# Altium project FMC_ADC_100M_10B_16CHA_TDC.PrjPCB (part 4 of 5)

## Sheet CFD.SchDoc: FMC_ADC
size 420 x 297 mm; Author: G.Kasprowicz; CompanyName: WUT ISE; DrawnBy: G.Kasprowicz; Organization: WUT ISE; Address1: PW ISE; Address2: Nowowiejska 15/19 00-665 Warsaw; Address3: gkasprow@gmail.com; Revision: 2; SheetNumber: -; SheetTotal: -; ModifiedBy: -; CheckedDate: -; Title2: CFD, ADC driver; DivGrp: WUT ISE; Designer: G.Kasprowicz; ModifiedDate: -; ProjectName: Sensor Box
Used 16 times, as channels U_CFD0, U_CFD1, U_CFD2, U_CFD3, U_CFD4, U_CFD5, U_CFD6, U_CFD7, U_CFD8, U_CFD9, U_CFD10, U_CFD11, U_CFD12, U_CFD13, U_CFD14, U_CFD15. Parts and nets are listed once, with the designators drawn on the sheet.
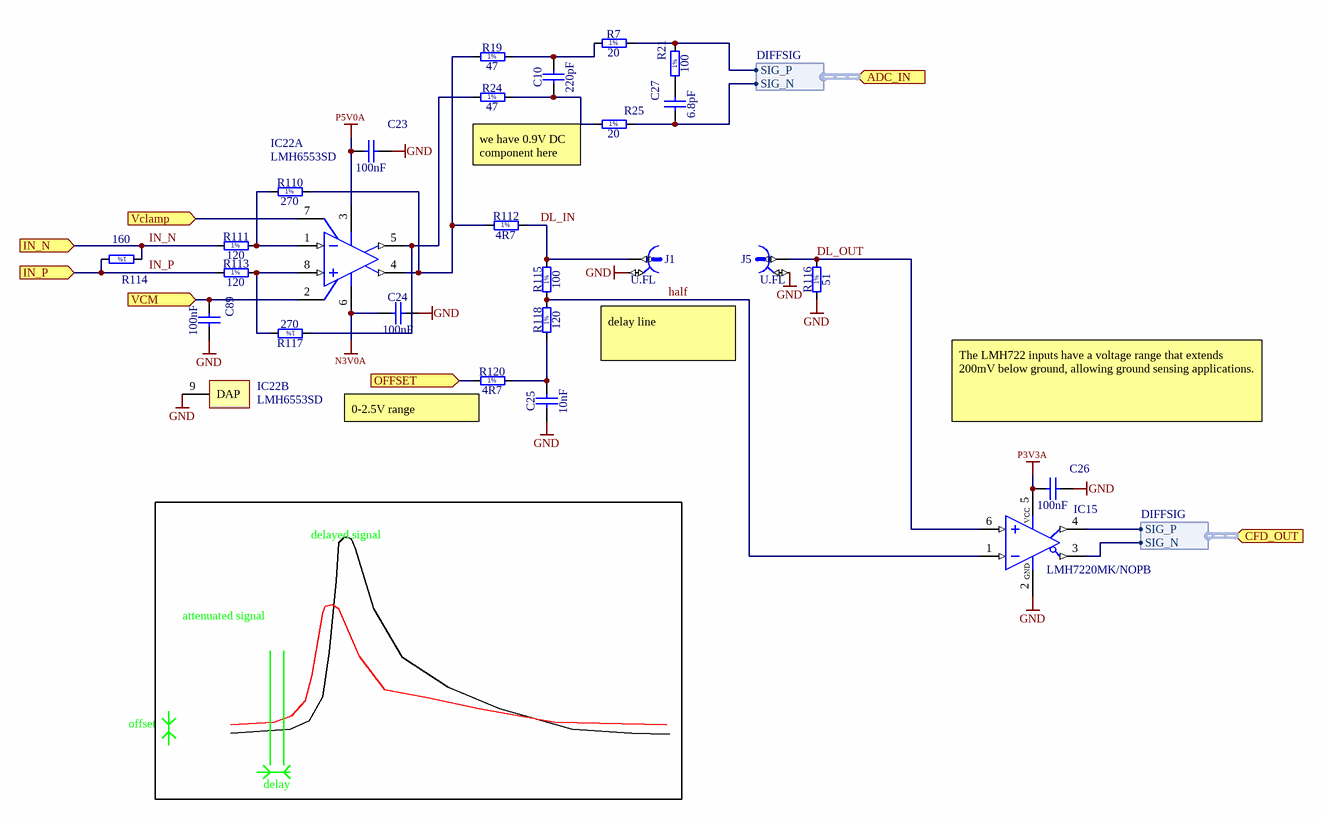
[diagram p8: CFD.SchDoc]

### Parts
C10  220pF  [CAPC1005X55N]
C23  100nF  [CAPC0603X33N]
C24  100nF  [CAPC0603X33N]
C25  10nF  [CAPC1005X55N]
C26  100nF  [CAPC0603X33N]
C27  6.8pF  [CAPC1005X70N]
C89  100nF  [CAPC0603X33N]
IC15  LMH7220MK/NOPB  [SOT95P285X100-6N]
IC22  LMH6553SD  [SDA08C]  (parts A,B of 2)
J1  U.FL  [HIROSE_U.FL-R-SMT-1(10)]
J5  U.FL  [HIROSE_U.FL-R-SMT-1(10)]
R7  20  [RESC1005X40N]
R19  47  [RESC1005X40N]
R21  100  [RESC0603X28N]
R24  47  [RESC1005X40N]
R25  20  [RESC1005X40N]
R110  270  [RESC1005X40N]
R111  120  [RESC1005X40N]
R112  4R7  [RESC1005X40N]
R113  120  [RESC1005X40N]
R114  160  [RESC1005X40N]
R115  100  [RESC0603X28N]
R116  51  [RESC1005X40N]
R117  270  [RESC1005X40N]
R118  120  [RESC1005X40N]
R120  4R7  [RESC1005X40N]

### Ports
ADC_IN (in, harness DIFFSIG), CFD_OUT (in, harness DIFFSIG), IN_N (in), IN_P (in), OFFSET (in), Vclamp (in), VCM (in)

### Harnesses
DIFFSIG: SIG_P, SIG_N

### Nets
GND: C23.2 C24.2 C25.1 C26.2 C89.2 IC15.2(GND) IC22.9(DAP) J1.2 J5.2 R116.1
N3V0A: C24.1 IC22.6(V-)
P3V3A: C26.1 IC15.5(VCC)
P5V0A: C23.1 IC22.3(V+)
DL_IN: J1.1 R112.2 R115.2
DL_OUT: IC15.6(IN+) J5.1 R116.2
half: IC15.1(IN-) R115.1 R118.2
IN_N: R111.1 R114.1 ; port IN_N
IN_P: R113.1 R114.2 ; port IN_P
OFFSET: R120.1 ; port OFFSET
Vclamp: IC22.7(VCLAMP) ; port Vclamp
VCM: C89.1 IC22.2(VCM) ; port VCM
NetC10_1: C10.1 R24.2 R25.1
NetC10_2: C10.2 R7.1 R19.2
NetC25_2: C25.2 R118.1 R120.2
NetC27_1: C27.1 R25.2 ; port ADC_IN.SIG_N
NetC27_2: C27.2 R21.1
NetIC15_3: IC15.3(VOUT~{Q}) ; port CFD_OUT.SIG_N
NetIC15_4: IC15.4(VOUTQ) ; port CFD_OUT.SIG_P
NetIC22_1: IC22.1(IN-) R110.1 R111.2
NetIC22_4: IC22.4(OUT+) R19.1 R110.2 R112.1
NetIC22_5: IC22.5(OUT-) R24.1 R117.1
NetIC22_8: IC22.8(IN+) R113.2 R117.2
NetR7_2: R7.2 R21.2 ; port ADC_IN.SIG_P

### Channels
U_CFD0: designators end in A; ports IN_N=IN0_N IN_P=IN0_P OFFSET=CFD_OFFSET0 Vclamp=CFD_CLAMP VCM=VCM0
U_CFD1: designators end in B; ports IN_N=IN1_N IN_P=IN1_P OFFSET=CFD_OFFSET1 Vclamp=CFD_CLAMP VCM=VCM0
U_CFD2: designators end in C; ports IN_N=IN2_N IN_P=IN2_P OFFSET=CFD_OFFSET2 Vclamp=CFD_CLAMP VCM=VCM0
U_CFD3: designators end in D; ports IN_N=IN3_N IN_P=IN3_P OFFSET=CFD_OFFSET3 Vclamp=CFD_CLAMP VCM=VCM0
U_CFD4: designators end in E; ports IN_N=IN4_N IN_P=IN4_P OFFSET=CFD_OFFSET4 Vclamp=CFD_CLAMP VCM=VCM0
U_CFD5: designators end in F; ports IN_N=IN5_N IN_P=IN5_P OFFSET=CFD_OFFSET5 Vclamp=CFD_CLAMP VCM=VCM0
U_CFD6: designators end in G; ports IN_N=IN6_N IN_P=IN6_P OFFSET=CFD_OFFSET6 Vclamp=CFD_CLAMP VCM=VCM0
U_CFD7: designators end in H; ports IN_N=IN7_N IN_P=IN7_P OFFSET=CFD_OFFSET7 Vclamp=CFD_CLAMP VCM=VCM0
U_CFD8: designators end in I; ports IN_N=IN8_N IN_P=IN8_P OFFSET=CFD_OFFSET8 Vclamp=CFD_CLAMP VCM=VCM1
U_CFD9: designators end in J; ports IN_N=IN9_N IN_P=IN9_P OFFSET=CFD_OFFSET9 Vclamp=CFD_CLAMP VCM=VCM1
U_CFD10: designators end in K; ports IN_N=IN10_N IN_P=IN10_P OFFSET=CFD_OFFSET10 Vclamp=CFD_CLAMP VCM=VCM1
U_CFD11: designators end in L; ports IN_N=IN11_N IN_P=IN11_P OFFSET=CFD_OFFSET11 Vclamp=CFD_CLAMP VCM=VCM1
U_CFD12: designators end in M; ports IN_N=IN12_N IN_P=IN12_P OFFSET=CFD_OFFSET12 Vclamp=CFD_CLAMP VCM=VCM1
U_CFD13: designators end in N; ports IN_N=IN13_N IN_P=IN13_P OFFSET=CFD_OFFSET13 Vclamp=CFD_CLAMP VCM=VCM1
U_CFD14: designators end in O; ports IN_N=IN14_N IN_P=IN14_P OFFSET=CFD_OFFSET14 Vclamp=CFD_CLAMP VCM=VCM1
U_CFD15: designators end in P; ports IN_N=IN15_N IN_P=IN15_P OFFSET=CFD_OFFSET15 Vclamp=CFD_CLAMP VCM=VCM1

### Notes on the sheet
- we have 0.9V DC component here
- delay line
- (near R120) 0-2.5V range
- The LMH722 inputs have a voltage range that extends  200mV below ground, allowing ground sensing applications.
- delayed signal
- attenuated signal
- offset
- delay
- Project/Equipment
- Document
- Designer
- Drawn by
- Check.by
- Copyright WUT ISE 2018.
  This documentation describes Open Hardware and is licensed under the CERN OHL v.1.1. You may redistribute and modify this documentation under the terms of the CERN OHL v.1.1. (http://ohwr.org/CERNOHL). This documentation is distributed WITHOUT ANY EXPRESS OR IMPLIED WARRANTY, INCLUDING OF MERCHANTABILITY, SATISFACTORY QUALITY AND FITNESS FOR A PARTICULAR PURPOSE. Please see the CERN OHL v.1.1 for applicable conditions.
- Contact
- File
- Last Mod.
- Print Date
- Sheet
- Size
- A3
- of
- Rev
- (in symbol R0201_100R_1%_0.05W_200PPM) 1%
- (in symbol R0402_4R7_1%_0.0625W_200PPM) 1%
- (in symbol R0402_20R_1%_0.0625W_100PPM) 1%
- (in symbol R0402_47R_1%_0.0625W_100PPM) 1%
- (in symbol R0402_51R_1%_0.0625W_100PPM) 1%
- (in symbol R0402_120R_1%_0.0625W_100PPM) 1%
- (in symbol R0402_160R_1%_0.0625W_100PPM) 1%
- (in symbol R0402_270R_1%_0.0625W_100PPM) 1%

### Library data of the parts
C10 = CC0402_220PF_50V_5%_C0G: Non-polarised capacitor; Part Description: SMD Multilayer Chip Ceramic Capacitor; Manufacturer: GENERIC; Manufacturer1 Part Number: C0402C221J5GACTU; Voltage: 50V; TC: C0G/NP0; Tolerance: ±5%; Part Number: CC0402_220PF_50V_5%_C0G; Component Kind: Standard; Component Type: Standard; Pin Count: 2; Value: 220pF; Status: Preferred; Manufacturer Part Number: CC0402_220PF_50V_5%_C0G; Case: 0402; Mounted: Yes; Socket: No; SMD: Yes; Sense: No; Manufacturer1 ComponentHeight: 0.55mm; HelpURL: \\cern.ch\dfs\Applications\Altium\Datasheets\CC0805_C0G_KEMET_(Commercial Grade).pdf; Author: CERN DEM JLC; CreateDate: 03.12.2007; LatestRevisionDate: 22.04.2015; Manufacturer1 Example: KEMET
C23 C24 C26 C89 = CC0201_100NF_6.3V_10%_X5R: Non-polarised capacitor; Part Description: SMD Multilayer Chip Ceramic Capacitor; Manufacturer: GENERIC; Manufacturer1 Part Number: 02016D104KAT2A; Voltage: 6.3V; TC: X5R; Tolerance: ±10%; Part Number: CC0201_100NF_6.3V_10%_X5R; Component Kind: Standard; Component Type: Standard; Pin Count: 2; Value: 100nF; Status: Not Recommended; Manufacturer Part Number: CC0201_100NF_6.3V_10%_X5R; Case: 0201; Mounted: Yes; Socket: No; SMD: Yes; Sense: No; Manufacturer1 Example: AVX; Manufacturer1 ComponentHeight: 0.33mm; HelpURL: \\cern.ch\dfs\Applications\Altium\Datasheets\CC0201_X5R_AVX.pdf; Author: CERN DEM JLC; CreateDate: 03.12.2007; LatestRevisionDate: 03.12.2007
C25 = CC0402_10NF_16V_10%_X7R: Non-polarised capacitor; Part Description: SMD Multilayer Chip Ceramic Capacitor; Manufacturer: GENERIC; Manufacturer1 Part Number: 223878715636; Voltage: 16V; TC: X7R; Tolerance: ±10%; Part Number: CC0402_10NF_16V_10%_X7R; Component Kind: Standard; Component Type: Standard; Pin Count: 2; Value: 10nF; Status: Not Recommended; Manufacturer Part Number: CC0402_10NF_16V_10%_X7R; Case: 0402; Mounted: Yes; Socket: No; SMD: Yes; Sense: No; Manufacturer1 Example: PHYCOMP; Manufacturer1 ComponentHeight: 0.55mm; HelpURL: \\cern.ch\dfs\Applications\Altium\Datasheets\CC0402_X7R_PHYCOMP.pdf; Author: CERN DEM JLC; CreateDate: 03.12.2007; LatestRevisionDate: 03.12.2007
C27 = CC0402_6.8PF_50V_0.25PF_C0G_VISHAY_VJ_NON-MAGNETIC: Non-polarised capacitor; Part Description: Surface Mount Multilayer Ceramic Chip Capacitors for Non-Magnetic Applications (IR Reflow Soldering); Manufacturer: VISHAY VITRAMON; Manufacturer Part Number: VJ0402A6R8CCAA; Voltage: 50V; TC: C0G/NP0; Tolerance: ±0.25pF; Part Number: CC0402_6.8PF_50V_0.25PF_C0G_VISHAY_VJ_NON-MAGNETIC; Component Kind: Standard; Component Type: Standard; Pin Count: 2; Value: 6.8pF; Status: Not Recommended; Case: 0402; Mounted: Yes; Socket: No; SMD: Yes; Sense: No; ComponentHeight: 0.64mm; HelpURL: \\cern.ch\dfs\Applications\Altium\Datasheets\CC0402_VISHAY_VJ_NON-MAGNETIC.pdf; Author: CERN DEM MR; CreateDate: 22.06.2016; LatestRevisionDate: 03.03.2017
IC15 = LMH7220MK/NOPB: High Speed Comparator with LVDS Output; Manufacturer: NATIONAL SEMICONDUCTOR; PressFit: No; Bonding: No; Part Number: LMH7220MK/NOPB; Component Kind: Standard; Component Type: Standard; Device: LMH7220MK/NOPB; PackageDescription: 0.95mm, pitch; 6 pin, 1.65mm W X 2.97mm L X 1.00mm H body IPC Medium Density; Part Description: High Speed Comparator with LVDS Output; Manufacturer Part Number: LMH7220MK/NOPB; Pin Count: 6; Case: SOT23-6; Mounted: Yes; Socket: No; SMD: Yes; Sense: No; ComponentHeight: 1mm; Author: CERN DEM JLC; HelpURL: \\cern.ch\dfs\Applications\Altium\Datasheets\LMH7220MK-NOPB.pdf; CreateDate: 30.03.2010; LatestRevisionDate: 30.03.2010
IC22 = CMP-0055-00983-1: 900 MHz Fully Differential Amplifier with Output Limiting Clamp, 8-pin LLP; Manufacturer: National Semiconductor; CompType: Amplifiers; PowerWise: Y; PackageTopMarking: XYTT*6553; PackageVersion: revA, Jan-2004; PackageDescription: LLP, Plastic, Dual, 2.5 x 3.0 x 0.8mm Body, 8 Lead, 0.5mm Pitch, No Pullback; PinCount: 8; PackageReference: SDA08C; DatasheetVersion: Nov-2008; RoHS: Y
J1 J5 = HIROSE_U.FL-R-SMT-1(10): Part Description: Up to 6GHz Ultra Small Surface Mount Male Coaxial Connectors U.FL Series; Manufacturer: HIROSE (HRS); PressFit: No; Part Number: HIROSE_U.FL-R-SMT-1(10); Component Kind: Standard; Component Type: Standard; Pin Count: 2; Family: U.FL; Mounted: Yes; Socket: No; SMD: Yes; Sense: No; Status: None; Manufacturer Part Number: U.FL-R-SMT-1(10); ComponentHeight: 1.25mm; HelpURL: \\cern.ch\dfs\Applications\Altium\Datasheets\HIROSE_U.FL-R-SMT-1(10).pdf; Author: CERN DEM JLC; CreateDate: 24.03.2010; LatestRevisionDate: 24.03.2010
R7 R25 = R0402_20R_1%_0.0625W_100PPM: Resistor - 1%; Part Description: General Purpose Thick Film Chip Resistor; Manufacturer: GENERIC; Manufacturer1 Part Number: 232270672009L; TC: ±100ppm/°C; PressFit: No; Part Number: R0402_20R_1%_0.0625W_100PPM; Component Kind: Standard; Component Type: Standard; Pin Count: 2; Value: 20; Status: Not Recommended; Power: 0.0625W; Tolerance: ±1%; Manufacturer Part Number: R0402_20R_1%_0.0625W_100PPM; Case: 0402; Mounted: Yes; Sense: No; Socket: No; SMD: Yes; Manufacturer1 Example: YAGEO PHYCOMP; Manufacturer1 ComponentHeight: 0.4mm; HelpURL: \\cern.ch\dfs\Applications\Altium\Datasheets\R0402_Phycomp_RC0402.pdf; Author: CERN DEM JLC; CreateDate: 03.12.2007; LatestRevisionDate: 17.10.2012
R19 R24 = R0402_47R_1%_0.0625W_100PPM: Resistor - 1%; Part Description: General Purpose Thick Film Chip Resistor; Manufacturer: GENERIC; Manufacturer1 Part Number: 232270674709L; TC: ±100ppm/°C; PressFit: No; Part Number: R0402_47R_1%_0.0625W_100PPM; Component Kind: Standard; Component Type: Standard; Pin Count: 2; Value: 47; Status: Not Recommended; Power: 0.0625W; Tolerance: ±1%; Manufacturer Part Number: R0402_47R_1%_0.0625W_100PPM; Case: 0402; Mounted: Yes; Sense: No; Socket: No; SMD: Yes; Manufacturer1 Example: YAGEO PHYCOMP; Manufacturer1 ComponentHeight: 0.4mm; HelpURL: \\cern.ch\dfs\Applications\Altium\Datasheets\R0402_Phycomp_RC0402.pdf; Author: CERN DEM JLC; CreateDate: 03.12.2007; LatestRevisionDate: 17.10.2012
R21 R115 = R0201_100R_1%_0.05W_200PPM: Resistor - 1%; Part Description: Thick Film Chip Resistor; Manufacturer: GENERIC; Manufacturer1 Part Number: CRCW0201100RFNED; Power: 0.05W; TC: ±200ppm/°C; PressFit: No; Part Number: R0201_100R_1%_0.05W_200PPM; Component Kind: Standard; Component Type: Standard; Pin Count: 2; Value: 100; Status: Not Recommended; Tolerance: ±1%; Manufacturer Part Number: R0201_100R_1%_0.05W_200PPM; Case: 0201; Mounted: Yes; Sense: No; Socket: No; SMD: Yes; Manufacturer1 Example: VISHAY; Manufacturer1 ComponentHeight: 0.27mm; HelpURL: \\cern.ch\dfs\Applications\Altium\Datasheets\R0201_VISHAY_CRCW0201 e3.pdf; Author: CERN DEM JLC; CreateDate: 13.11.2014; LatestRevisionDate: 13.11.2014
R110 R117 = R0402_270R_1%_0.0625W_100PPM: Resistor - 1%; Part Description: General Purpose Thick Film Chip Resistor; Manufacturer: GENERIC; Manufacturer1 Part Number: 232270672701L; TC: ±100ppm/°C; PressFit: No; Part Number: R0402_270R_1%_0.0625W_100PPM; Component Kind: Standard; Component Type: Standard; Pin Count: 2; Value: 270; Status: Not Recommended; Power: 0.0625W; Tolerance: ±1%; Manufacturer Part Number: R0402_270R_1%_0.0625W_100PPM; Case: 0402; Mounted: Yes; Sense: No; Socket: No; SMD: Yes; Manufacturer1 Example: YAGEO PHYCOMP; Manufacturer1 ComponentHeight: 0.4mm; HelpURL: \\cern.ch\dfs\Applications\Altium\Datasheets\R0402_Phycomp_RC0402.pdf; Author: CERN DEM JLC; CreateDate: 03.12.2007; LatestRevisionDate: 17.10.2012
R111 R113 R118 = R0402_120R_1%_0.0625W_100PPM: Resistor - 1%; Part Description: General Purpose Thick Film Chip Resistor; Manufacturer: GENERIC; Manufacturer1 Part Number: 232270671201L; TC: ±100ppm/°C; PressFit: No; Part Number: R0402_120R_1%_0.0625W_100PPM; Component Kind: Standard; Component Type: Standard; Pin Count: 2; Value: 120; Status: Not Recommended; Power: 0.0625W; Tolerance: ±1%; Manufacturer Part Number: R0402_120R_1%_0.0625W_100PPM; Case: 0402; Mounted: Yes; Sense: No; Socket: No; SMD: Yes; Manufacturer1 Example: YAGEO PHYCOMP; Manufacturer1 ComponentHeight: 0.4mm; HelpURL: \\cern.ch\dfs\Applications\Altium\Datasheets\R0402_Phycomp_RC0402.pdf; Author: CERN DEM JLC; CreateDate: 03.12.2007; LatestRevisionDate: 17.10.2012
R112 R120 = R0402_4R7_1%_0.0625W_200PPM: Resistor - 1%; Part Description: General Purpose Thick Film Chip Resistor; Manufacturer: GENERIC; Manufacturer1 Part Number: 232270674708L; TC: ±200ppm/°C; PressFit: No; Part Number: R0402_4R7_1%_0.0625W_200PPM; Component Kind: Standard; Component Type: Standard; Pin Count: 2; Value: 4R7; Status: Not Recommended; Power: 0.0625W; Tolerance: ±1%; Manufacturer Part Number: R0402_4R7_1%_0.0625W_200PPM; Case: 0402; Mounted: Yes; Sense: No; Socket: No; SMD: Yes; Manufacturer1 Example: YAGEO PHYCOMP; Manufacturer1 ComponentHeight: 0.4mm; HelpURL: \\cern.ch\dfs\Applications\Altium\Datasheets\R0402_Phycomp_RC0402.pdf; Author: CERN DEM JLC; CreateDate: 03.12.2007; LatestRevisionDate: 17.10.2012
R114 = R0402_160R_1%_0.0625W_100PPM: Resistor - 1%; Part Description: General Purpose Thick Film Chip Resistor; Manufacturer: GENERIC; Manufacturer1 Part Number: 232270671601L; TC: ±100ppm/°C; PressFit: No; Part Number: R0402_160R_1%_0.0625W_100PPM; Component Kind: Standard; Component Type: Standard; Pin Count: 2; Value: 160; Status: Not Recommended; Power: 0.0625W; Tolerance: ±1%; Manufacturer Part Number: R0402_160R_1%_0.0625W_100PPM; Case: 0402; Mounted: Yes; Sense: No; Socket: No; SMD: Yes; Manufacturer1 Example: YAGEO PHYCOMP; Manufacturer1 ComponentHeight: 0.4mm; HelpURL: \\cern.ch\dfs\Applications\Altium\Datasheets\R0402_Phycomp_RC0402.pdf; Author: CERN DEM JLC; CreateDate: 03.12.2007; LatestRevisionDate: 17.10.2012
R116 = R0402_51R_1%_0.0625W_100PPM: Resistor - 1%; Part Description: General Purpose Thick Film Chip Resistor; Manufacturer: GENERIC; Manufacturer1 Part Number: 232270675109L; TC: ±100ppm/°C; PressFit: No; Part Number: R0402_51R_1%_0.0625W_100PPM; Component Kind: Standard; Component Type: Standard; Pin Count: 2; Value: 51; Status: Not Recommended; Power: 0.0625W; Tolerance: ±1%; Manufacturer Part Number: R0402_51R_1%_0.0625W_100PPM; Case: 0402; Mounted: Yes; Sense: No; Socket: No; SMD: Yes; Manufacturer1 Example: YAGEO PHYCOMP; Manufacturer1 ComponentHeight: 0.4mm; HelpURL: \\cern.ch\dfs\Applications\Altium\Datasheets\R0402_Phycomp_RC0402.pdf; Author: CERN DEM JLC; CreateDate: 03.12.2007; LatestRevisionDate: 17.10.2012

## Sheet DACs.SchDoc: FMC_ADC
size 420 x 297 mm; Author: G.Kasprowicz; CompanyName: WUT ISE; DrawnBy: G.Kasprowicz; Organization: WUT ISE; Address1: PW ISE; Address2: Nowowiejska 15/19 00-665 Warsaw; Address3: gkasprow@gmail.com; Revision: 2; SheetNumber: -; SheetTotal: -; ModifiedBy: -; CheckedDate: -; Title2: CFD Offset DAC; DivGrp: WUT ISE; Designer: G.Kasprowicz; ModifiedDate: -; ProjectName: Sensor Box
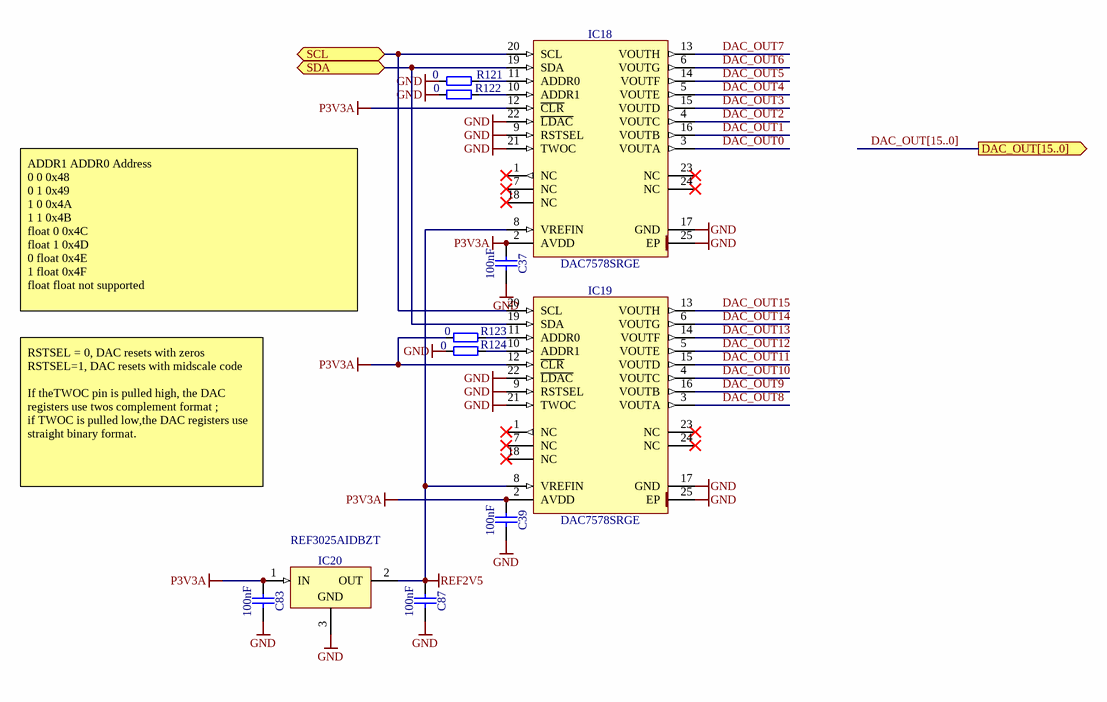
[diagram p9: DACs.SchDoc]

### Parts
C37  100nF  [CAPC0603X33N]
C39  100nF  [CAPC0603X33N]
C83  100nF  [CAPC0603X33N]
C87  100nF  [CAPC0603X33N]
IC18  DAC7578SRGE  [QFN50P400X400X100-25N-S280]
IC19  DAC7578SRGE  [QFN50P400X400X100-25N-S280]
IC20  REF3025AIDBZT  [SOT95P237X112-3N]
R121  0  [RESC1005X40N]
R122  0  [RESC1005X40N]
R123  0  [RESC1005X40N]
R124  0  [RESC1005X40N]

### Ports
DAC_OUT[15..0] (out), SCL (bidir), SDA (bidir)

### Nets
GND: C37.2 C39.2 C83.2 C87.2 IC18.9(RSTSEL) IC18.17(GND) IC18.21(TWOC) IC18.22(~{LDAC}) IC18.25(EP) IC19.9(RSTSEL) IC19.17(GND) IC19.21(TWOC) IC19.22(~{LDAC}) IC19.25(EP) IC20.3(GND) R121.1 R122.1 R124.1
P3V3A: C37.1 C39.1 C83.1 IC18.2(AVDD) IC18.12(~{CLR}) IC19.2(AVDD) IC19.12(~{CLR}) IC20.1(IN) R123.1  [project net DVDD33]
REF2V5: C87.1 IC18.8(VREFIN) IC19.8(VREFIN) IC20.2(OUT)
DAC_OUT0: IC18.3(VOUTA)  [project net CFD_OFFSET0]
DAC_OUT1: IC18.16(VOUTB)  [project net CFD_OFFSET1]
DAC_OUT2: IC18.4(VOUTC)  [project net CFD_OFFSET2]
DAC_OUT3: IC18.15(VOUTD)  [project net CFD_OFFSET3]
DAC_OUT4: IC18.5(VOUTE)  [project net CFD_OFFSET4]
DAC_OUT5: IC18.14(VOUTF)  [project net CFD_OFFSET5]
DAC_OUT6: IC18.6(VOUTG)  [project net CFD_OFFSET6]
DAC_OUT7: IC18.13(VOUTH)  [project net CFD_OFFSET7]
DAC_OUT8: IC19.3(VOUTA)  [project net CFD_OFFSET8]
DAC_OUT9: IC19.16(VOUTB)  [project net CFD_OFFSET9]
DAC_OUT10: IC19.4(VOUTC)  [project net CFD_OFFSET10]
DAC_OUT11: IC19.15(VOUTD)  [project net CFD_OFFSET11]
DAC_OUT12: IC19.5(VOUTE)  [project net CFD_OFFSET12]
DAC_OUT13: IC19.14(VOUTF)  [project net CFD_OFFSET13]
DAC_OUT14: IC19.6(VOUTG)  [project net CFD_OFFSET14]
DAC_OUT15: IC19.13(VOUTH)  [project net CFD_OFFSET15]
NetIC18_10: IC18.10(ADDR1) R122.2
NetIC18_11: IC18.11(ADDR0) R121.2
NetIC18_19: IC18.19(SDA) IC19.19(SDA) ; port SDA
NetIC18_20: IC18.20(SCL) IC19.20(SCL) ; port SCL
NetIC19_10: IC19.10(ADDR1) R124.2
NetIC19_11: IC19.11(ADDR0) R123.2

Not connected (* = marked no-connect by the designer): IC18 1(NC)* 7(NC)* 18(NC)* 23(NC)* 24(NC)*; IC19 1(NC)* 7(NC)* 18(NC)* 23(NC)* 24(NC)*

### Buses and harness runs
bus DAC_OUT[15..0] = port DAC_OUT[15..0]

### Notes on the sheet
- ADDR1	ADDR0	Address
  0	0	0x48
  0	1	0x49
  1	0	0x4A
  1	1	0x4B
  float	0	0x4C
  float	1	0x4D
  0	float	0x4E
  1	float	0x4F
  float	float	not supported
- RSTSEL = 0, DAC resets with zeros
  RSTSEL=1, DAC resets with midscale code
  If theTWOC pin is pulled high, the DAC registers use twos complement format ;
  if TWOC is pulled low,the DAC registers use straight binary format.
- Project/Equipment
- Document
- Designer
- Drawn by
- Check.by
- Copyright WUT ISE 2018.
  This documentation describes Open Hardware and is licensed under the CERN OHL v.1.1. You may redistribute and modify this documentation under the terms of the CERN OHL v.1.1. (http://ohwr.org/CERNOHL). This documentation is distributed WITHOUT ANY EXPRESS OR IMPLIED WARRANTY, INCLUDING OF MERCHANTABILITY, SATISFACTORY QUALITY AND FITNESS FOR A PARTICULAR PURPOSE. Please see the CERN OHL v.1.1 for applicable conditions.
- Contact
- File
- Last Mod.
- Print Date
- Sheet
- Size
- A3
- of
- Rev

### Library data of the parts
C37 C39 C83 C87 = CC0201_100NF_6.3V_10%_X5R: as C23 on sheet CFD; Part Number: CC0201_100NF_6.3V_10%_X5R; Component Kind: Standard; Component Type: Standard; Pin Count: 2; Value: 100nF; Status: Not Recommended; Manufacturer Part Number: CC0201_100NF_6.3V_10%_X5R; Case: 0201; Mounted: Yes; Socket: No; SMD: Yes; Sense: No; Manufacturer1 Example: AVX; Manufacturer1 ComponentHeight: 0.33mm; HelpURL: \\cern.ch\dfs\Applications\Altium\Datasheets\CC0201_X5R_AVX.pdf; Author: CERN DEM JLC; CreateDate: 03.12.2007; LatestRevisionDate: 03.12.2007
IC18 IC19 = DAC7578SRGE: 8-Bit, Octal-Channel, Ultra-Low Glitch, Voltage Output, Two-Wire Interface Digital-to-Analog Converter; Part Description: 12-Bit, Octal-Channel, Ultra-Low Glitch, Voltage Output, Two-Wire Interface Digital-To-Analog Converters; Manufacturer: TEXAS INSTRUMENTS; PressFit: No; Bonding: No; Part Number: DAC7578SRGE; Component Kind: Standard; Component Type: Standard; Device: DAC7578SRGE; PackageDescription: QFN, 0.50mm Pitch, Square; 24 Pin, 4.00mm L X 4.00mm W X 1.00mm H body(w/thermal tab 2.8 X 2.8mm), IPC Medium Density; Manufacturer Part Number: DAC7578SRGE; Pin Count: 25; Case: QFN24; Mounted: Yes; Socket: No; SMD: Yes; Sense: No; ComponentHeight: 1mm; Author: CERN DEM MR; HelpURL: \\cern.ch\dfs\Applications\Altium\Datasheets\DAC7578SRGE.pdf; CreateDate: 14.07.2016; LatestRevisionDate: 14.07.2016
IC20 = REF3025AIDBZT: 3-Terminal Regulator 1=IN 2=OUT 3=GND; Part Description: 2.5V, 50ppm/°C Max, 50uA, CMOS Voltage Reference; Manufacturer: TEXAS INSTRUMENTS; PressFit: No; Bonding: No; Part Number: REF3025AIDBZT; Component Kind: Standard; Component Type: Standard; Device: REF3025AIDBZT; PackageDescription: SOT, 0.95mm, pitch; 3 pin,1.30mm W X 2.92mm L X 1.12mm H body, IPC Medium Density; Manufacturer Part Number: REF3025AIDBZT; Pin Count: 3; Case: SOT23; Mounted: Yes; Socket: No; SMD: Yes; Sense: No; ComponentHeight: 1.12mm; HelpURL: \\cern.ch\dfs\Applications\Altium\Datasheets\REF3025AIDBZT.pdf; Author: CERN DEM JLC; CreateDate: 19.12.2016; LatestRevisionDate: 19.12.2016
R121-R124 = R0402_0R_JUMPER: Resistor; Part Description: 1A (0.05R Max DC Resistance) Zero Ohm Jumper; Manufacturer: GENERIC; Manufacturer1 Part Number: 232270591001L; PressFit: No; Part Number: R0402_0R_JUMPER; Component Kind: Standard; Component Type: Standard; Pin Count: 2; Value: 0; Status: Not Recommended; Manufacturer Part Number: R0402_0R_JUMPER; Case: 0402; Mounted: Yes; Sense: No; Socket: No; SMD: Yes; Manufacturer1 Example: YAGEO PHYCOMP; Manufacturer1 ComponentHeight: 0.4mm; HelpURL: \\cern.ch\dfs\Applications\Altium\Datasheets\R0402_Phycomp_RC0402.pdf; Author: CERN DEM JLC; CreateDate: 03.12.2007; LatestRevisionDate: 17.10.2012

## Sheet Translators.SchDoc: FMC_ADC
size 420 x 297 mm; Author: G.Kasprowicz; CompanyName: WUT ISE; DrawnBy: G.Kasprowicz; Organization: WUT ISE; Address1: PW ISE; Address2: Nowowiejska 15/19 00-665 Warsaw; Address3: gkasprow@gmail.com; Revision: 2; SheetNumber: -; SheetTotal: -; ModifiedBy: -; CheckedDate: -; Title2: 100M_10B_16CHA_TDC; DivGrp: WUT ISE; Designer: G.Kasprowicz; ModifiedDate: -; ProjectName: Sensor Box
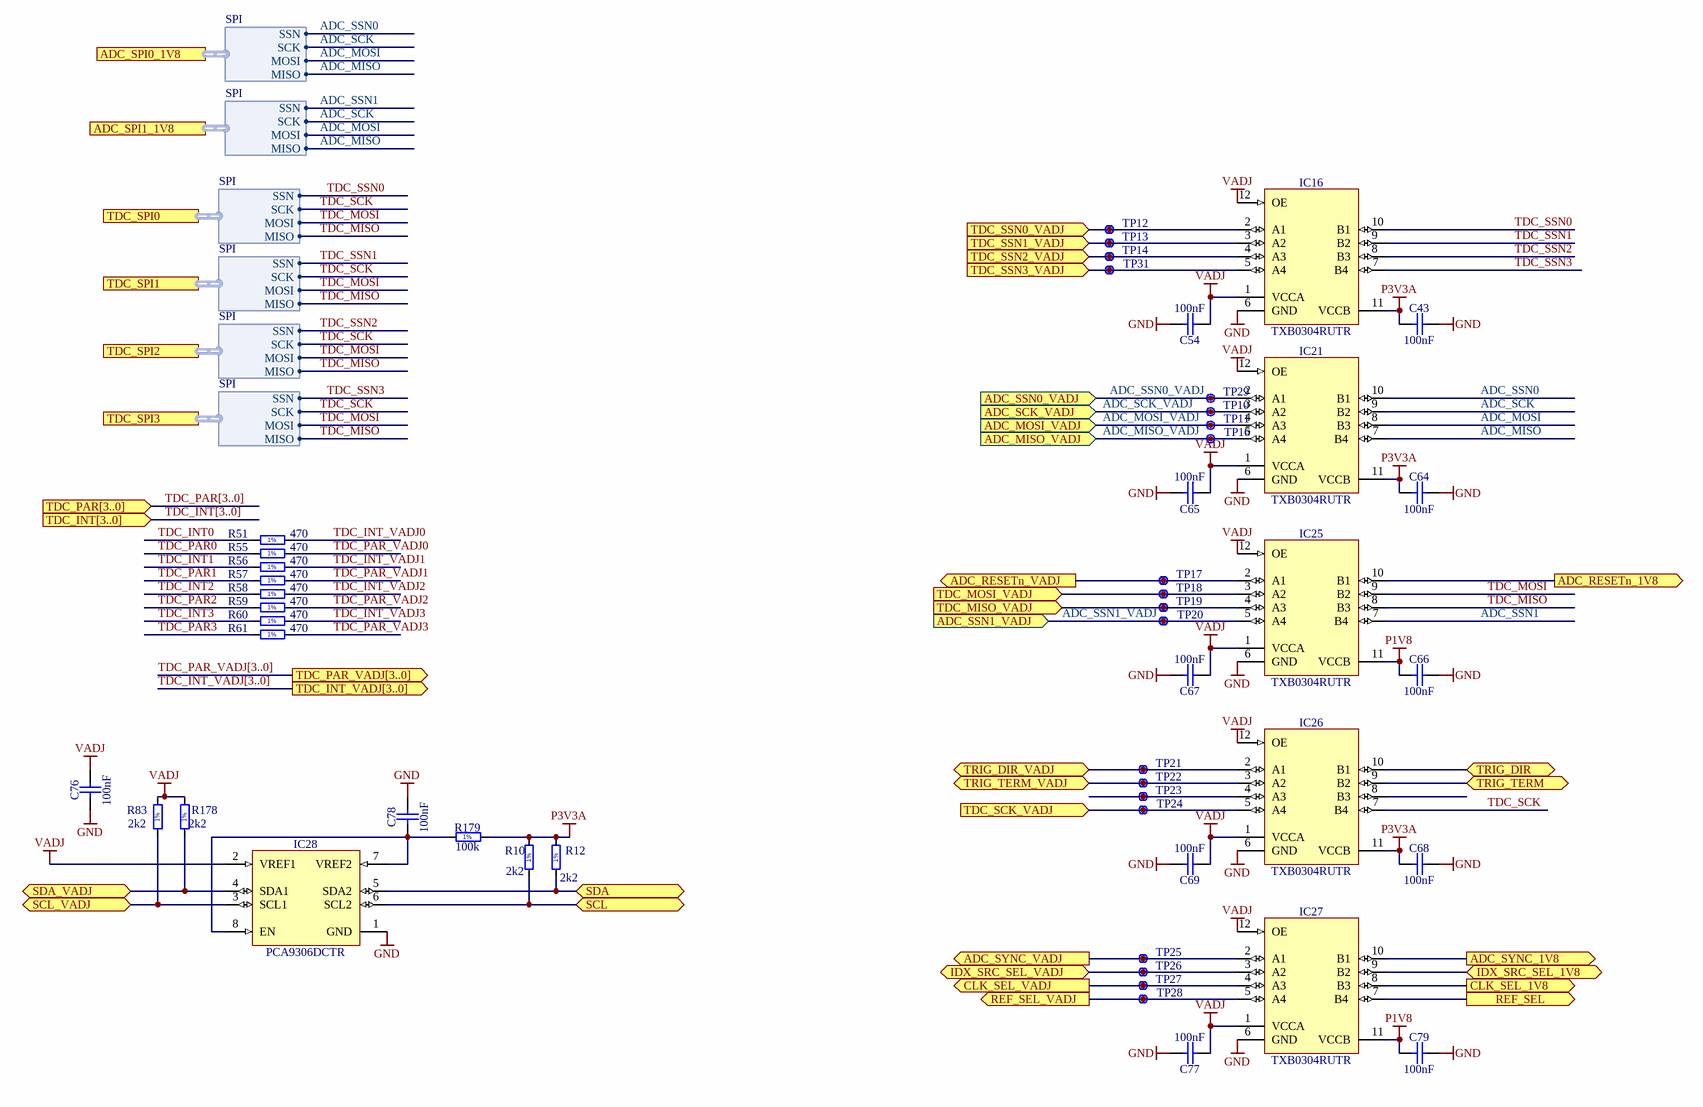
[diagram p10: Translators.SchDoc]

### Parts
C43  100nF  [CAPC0603X33N]
C54  100nF  [CAPC0603X33N]
C64  100nF  [CAPC0603X33N]
C65  100nF  [CAPC0603X33N]
C66  100nF  [CAPC0603X33N]
C67  100nF  [CAPC0603X33N]
C68  100nF  [CAPC0603X33N]
C69  100nF  [CAPC0603X33N]
C76  100nF  [CAPC0603X33N]
C77  100nF  [CAPC0603X33N]
C78  100nF  [CAPC0603X33N]
C79  100nF  [CAPC0603X33N]
IC16  TXB0304RUTR  [TEXAS_RUT (R-PUQFN-N12)]
IC21  TXB0304RUTR  [TEXAS_RUT (R-PUQFN-N12)]
IC25  TXB0304RUTR  [TEXAS_RUT (R-PUQFN-N12)]
IC26  TXB0304RUTR  [TEXAS_RUT (R-PUQFN-N12)]
IC27  TXB0304RUTR  [TEXAS_RUT (R-PUQFN-N12)]
IC28  PCA9306DCTR  [SOP65P400X130-8N]
R10  2k2  [RESC1005X40N]
R12  2k2  [RESC1005X40N]
R51  470  [RESC1005X40N]
R55  470  [RESC1005X40N]
R56  470  [RESC1005X40N]
R57  470  [RESC1005X40N]
R58  470  [RESC1005X40N]
R59  470  [RESC1005X40N]
R60  470  [RESC1005X40N]
R61  470  [RESC1005X40N]
R83  2k2  [RESC1005X40N]
R178  2k2  [RESC1005X40N]
R179  100k  [RESC1005X40N]
TP10  Test Point  [TPS62]  (value not drawn)
TP11  Test Point  [TPS62]  (value not drawn)
TP12  Test Point  [TPS62]  (value not drawn)
TP13  Test Point  [TPS62]  (value not drawn)
TP14  Test Point  [TPS62]  (value not drawn)
TP16  Test Point  [TPS62]  (value not drawn)
TP17  Test Point  [TPS62]  (value not drawn)
TP18  Test Point  [TPS62]  (value not drawn)
TP19  Test Point  [TPS62]  (value not drawn)
TP20  Test Point  [TPS62]  (value not drawn)
TP21  Test Point  [TPS62]  (value not drawn)
TP22  Test Point  [TPS62]  (value not drawn)
TP23  Test Point  [TPS62]  (value not drawn)
TP24  Test Point  [TPS62]  (value not drawn)
TP25  Test Point  [TPS62]  (value not drawn)
TP26  Test Point  [TPS62]  (value not drawn)
TP27  Test Point  [TPS62]  (value not drawn)
TP28  Test Point  [TPS62]  (value not drawn)
TP29  Test Point  [TPS62]  (value not drawn)
TP31  Test Point  [TPS62]  (value not drawn)

### Ports
ADC_MISO_VADJ (in), ADC_MOSI_VADJ (in), ADC_RESETn_1V8 (out), ADC_RESETn_VADJ (out), ADC_SCK_VADJ (in), ADC_SPI0_1V8 (harness SPI), ADC_SPI1_1V8 (harness SPI), ADC_SSN0_VADJ (in), ADC_SSN1_VADJ (in), ADC_SYNC_1V8 (out), ADC_SYNC_VADJ (out), CLK_SEL_1V8 (out), CLK_SEL_VADJ (out), IDX_SRC_SEL_1V8 (bidir), IDX_SRC_SEL_VADJ (bidir), REF_SEL (out), REF_SEL_VADJ (out), SCL (bidir), SCL_VADJ (bidir), SDA (bidir), SDA_VADJ (bidir), TDC_INT[3..0] (in), TDC_INT_VADJ[3..0] (out), TDC_MISO_VADJ (in), TDC_MOSI_VADJ (in), TDC_PAR[3..0] (in), TDC_PAR_VADJ[3..0] (out), TDC_SCK_VADJ (in), TDC_SPI0 (harness SPI), TDC_SPI1 (harness SPI), TDC_SPI2 (harness SPI), TDC_SPI3 (harness SPI), TDC_SSN0_VADJ (in), TDC_SSN1_VADJ (in), TDC_SSN2_VADJ (in), TDC_SSN3_VADJ (in), TRIG_DIR (bidir), TRIG_DIR_VADJ (bidir), TRIG_TERM (bidir), TRIG_TERM_VADJ (bidir)

### Harnesses
SPI: MISO, MOSI, SCK, SSN

### Nets
GND: C43.2 C54.2 C64.2 C65.2 C66.2 C67.2 C68.2 C69.2 C76.1 C77.2 C78.2 C79.2 IC16.6(GND) IC21.6(GND) IC25.6(GND) IC26.6(GND) IC27.6(GND) IC28.1(GND)
P1V8: C66.1 C79.1 IC25.11(VCCB) IC27.11(VCCB)
P3V3A: C43.1 C64.1 C68.1 IC16.11(VCCB) IC21.11(VCCB) IC26.11(VCCB) R10.2 R12.2 R179.2  [project net DVDD33]
VADJ: C54.1 C65.1 C67.1 C69.1 C76.2 C77.1 IC16.1(VCCA) IC16.12(OE) IC21.1(VCCA) IC21.12(OE) IC25.1(VCCA) IC25.12(OE) IC26.1(VCCA) IC26.12(OE) IC27.1(VCCA) IC27.12(OE) IC28.2(VREF1) R83.2 R178.2
ADC_MISO: IC21.7(B4) ; port ADC_SPI0_1V8.MISO, port ADC_SPI1_1V8.MISO
ADC_MISO_VADJ: IC21.5(A4) TP16.1 ; port ADC_MISO_VADJ
ADC_MOSI: IC21.8(B3) ; port ADC_SPI0_1V8.MOSI, port ADC_SPI1_1V8.MOSI
ADC_MOSI_VADJ: IC21.4(A3) TP11.1 ; port ADC_MOSI_VADJ
ADC_RESETn_1V8: IC25.10(B1) ; port ADC_RESETn_1V8
ADC_SCK: IC21.9(B2) ; port ADC_SPI0_1V8.SCK, port ADC_SPI1_1V8.SCK
ADC_SCK_VADJ: IC21.3(A2) IC28.4(SDA1) R178.1 TP10.1 ; port ADC_SCK_VADJ, port SDA_VADJ
ADC_SSN0: IC21.10(B1) ; port ADC_SPI0_1V8.SSN
ADC_SSN0_VADJ: IC21.2(A1) TP29.1 ; port ADC_SSN0_VADJ
ADC_SSN1: IC25.7(B4) ; port ADC_SPI1_1V8.SSN
ADC_SSN1_VADJ: IC25.5(A4) TP20.1 ; port ADC_SSN1_VADJ
ADC_SYNC_1V8: IC27.10(B1) ; port ADC_SYNC_1V8
IDX_SRC_SEL_1V8: IC27.9(B2) ; port IDX_SRC_SEL_1V8
LA12_N: IC16.4(A3) TP14.1 ; port TDC_SSN2_VADJ
LA12_P: IC16.3(A2) TP13.1 ; port TDC_SSN1_VADJ
LA13_N: IC16.2(A1) TP12.1 ; port TDC_SSN0_VADJ
LA13_P: IC25.3(A2) TP18.1 ; port TDC_MOSI_VADJ
LA14_N: IC25.4(A3) TP19.1 ; port TDC_MISO_VADJ
LA14_P: IC26.5(A4) TP24.1 ; port TDC_SCK_VADJ
LA27_N: IC27.4(A3) TP27.1 ; port CLK_SEL_VADJ
LA27_P: IC26.3(A2) TP22.1 ; port TRIG_TERM_VADJ
LA28_P: IC16.5(A4) IC28.3(SCL1) R83.1 TP31.1 ; port TDC_SSN3_VADJ, port SCL_VADJ
LA29_P: IC27.2(A1) TP25.1 ; port ADC_SYNC_VADJ
LA31_N: IC27.5(A4) TP28.1 ; port REF_SEL_VADJ
LA31_P: IC25.2(A1) TP17.1 ; port ADC_RESETn_VADJ
LA33_N: IC26.2(A1) TP21.1 ; port TRIG_DIR_VADJ
LA33_P: IC27.3(A2) TP26.1 ; port IDX_SRC_SEL_VADJ
TDC_INT0: R51.1  [project net IDC_INT0]
TDC_INT1: R56.1  [project net IDC_INT1]
TDC_INT2: R58.1  [project net IDC_INT2]
TDC_INT3: R60.1  [project net IDC_INT3]
TDC_INT_VADJ0: R51.2  [project net HB09_P]
TDC_INT_VADJ1: R56.2  [project net HB10_P]
TDC_INT_VADJ2: R58.2  [project net HB11_P]
TDC_INT_VADJ3: R60.2  [project net HB12_P]
TDC_MISO: IC25.8(B3) ; port TDC_SPI0.MISO, port TDC_SPI1.MISO, port TDC_SPI2.MISO, port TDC_SPI3.MISO
TDC_MOSI: IC25.9(B2) ; port TDC_SPI0.MOSI, port TDC_SPI1.MOSI, port TDC_SPI2.MOSI, port TDC_SPI3.MOSI
TDC_PAR0: R55.1
TDC_PAR1: R57.1
TDC_PAR2: R59.1
TDC_PAR3: R61.1
TDC_PAR_VADJ0: R55.2  [project net HB09_N]
TDC_PAR_VADJ1: R57.2  [project net HB10_N]
TDC_PAR_VADJ2: R59.2  [project net HB11_N]
TDC_PAR_VADJ3: R61.2  [project net HB12_N]
TDC_SCK: IC26.7(B4) ; port TDC_SPI0.SCK, port TDC_SPI1.SCK, port TDC_SPI2.SCK, port TDC_SPI3.SCK
TDC_SSN0: IC16.10(B1) ; port TDC_SPI0.SSN
TDC_SSN1: IC16.9(B2) ; port TDC_SPI1.SSN
TDC_SSN2: IC16.8(B3) ; port TDC_SPI2.SSN
TDC_SSN3: IC16.7(B4) ; port TDC_SPI3.SSN
TRIG_DIR: IC26.10(B1) ; port TRIG_DIR
TRIG_TERM: IC26.9(B2) ; port TRIG_TERM
NetC78_1: C78.1 IC28.7(VREF2) IC28.8(EN) R179.1
NetIC3_4: IC27.7(B4) ; port REF_SEL
NetIC18_19: IC28.5(SDA2) R12.1 ; port SDA
NetIC18_20: IC28.6(SCL2) R10.1 ; port SCL
NetIC26_4: IC26.4(A3) TP23.1
NetIC27_8: IC27.8(B3) ; port CLK_SEL_1V8

Not connected (* = marked no-connect by the designer): IC26 8(B3)

### Buses and harness runs
bus TDC_INT[3..0] = port TDC_INT[3..0]
bus TDC_INT_VADJ[3..0] = port TDC_INT_VADJ[3..0]
bus TDC_PAR[3..0] = port TDC_PAR[3..0]
bus TDC_PAR_VADJ[3..0] = port TDC_PAR_VADJ[3..0]

### Notes on the sheet
- Project/Equipment
- Document
- Designer
- Drawn by
- Check.by
- Copyright WUT ISE 2018.
  This documentation describes Open Hardware and is licensed under the CERN OHL v.1.1. You may redistribute and modify this documentation under the terms of the CERN OHL v.1.1. (http://ohwr.org/CERNOHL). This documentation is distributed WITHOUT ANY EXPRESS OR IMPLIED WARRANTY, INCLUDING OF MERCHANTABILITY, SATISFACTORY QUALITY AND FITNESS FOR A PARTICULAR PURPOSE. Please see the CERN OHL v.1.1 for applicable conditions.
- Contact
- File
- Last Mod.
- Print Date
- Sheet
- Size
- A3
- of
- Rev
- (in symbol R0402_2K2_1%_0.0625W_100PPM) 1%
- (in symbol R0402_100K_1%_0.0625W_100PPM) 1%
- (in symbol R0402_470R_1%_0.0625W_100PPM) 1%

### Library data of the parts
C43 C54 C64-C69 C76-C79 = CC0201_100NF_6.3V_10%_X5R: Non-polarised capacitor; Manufacturer: GENERIC; Part Description: SMD Multilayer Chip Ceramic Capacitor; Manufacturer1 Part Number: 02016D104KAT2A; Tolerance: ±10%; Voltage: 6.3V; TC: X5R; Manufacturer Part Number: CC0201_100NF_6.3V_10%_X5R; Part Number: CC0201_100NF_6.3V_10%_X5R; Value: 100nF; Component Kind: Standard; Component Type: Standard; Pin Count: 2; Status: Not Recommended; Case: 0201; Mounted: Yes; Socket: No; SMD: Yes; Sense: No; Manufacturer1 Example: AVX; Manufacturer1 ComponentHeight: 0.33mm; HelpURL: \\cern.ch\dfs\Applications\Altium\Datasheets\CC0201_X5R_AVX.pdf; Author: CERN DEM JLC; CreateDate: 03.12.2007; LatestRevisionDate: 03.12.2007
IC16 IC21 IC25-IC27 = TXB0304RUTR: 4-bit Bidirectional Auto-direction Sensing Translator with Fully Symmetric 0.9V to 3.6V Range; Manufacturer: TEXAS INSTRUMENTS; PressFit: No; Bonding: No; Manufacturer Part Number: TXB0304RUTR; PackageDescription: SON, TEXAS RUT (R-PUQFN-N12), 0.50mm Pitch, 12-pin, 1.70mm W  X 2.00mm L X 0.55mm Height; Part Description: 4-bit Bidirectional Auto-direction Sensing Translator with Fully Symmetric 0.9V to 3.6V Range; Part Number: TXB0304RUTR; Component Kind: Standard; Component Type: Standard; Device: TXB0304RUTR; Pin Count: 12; Case: QFN12; Mounted: Yes; Socket: No; SMD: Yes; Sense: No; ComponentHeight: 0.55mm; Author: CERN DEM JLC; HelpURL: \\cern.ch\dfs\Applications\Altium\Datasheets\TXB0304RUTR.pdf; CreateDate: 27.10.2014; LatestRevisionDate: 28.10.2014
IC28 = PCA9306DCTR: Dual Bidirectional I2C Bus And SMBus Voltage-Level Translator; Manufacturer: TEXAS INSTRUMENTS; Table: Analog & Interface; Part Number: PCA9306DCTR; Component Kind: Standard; Component Type: Standard; Device: PCA9306DCTR; PackageDescription: SOP, 0.65mm, Pitch; 8 Pin, 2.80mm W X 2.95mm L X 1.30mm H Body, PC Medium Density; Part Description: Dual Bidirectional I2C Bus And SMBus Voltage-Level Translator; Manufacturer Part Number: PCA9306DCTR; Pin Count: 8; Case: SSOP8; Mounted: Yes; Socket: No; SMD: Yes; ComponentHeight: 1.3mm; Author: CERN DEM JLC; HelpURL: \\cern.ch\dfs\Applications\Altium\Datasheets\PCA9306DCTR.pdf; CreateDate: 2013-02-25; LatestRevisionDate: 2013-02-25
R10 R12 R83 R178 = R0402_2K2_1%_0.0625W_100PPM: Resistor - 1%; Part Description: General Purpose Thick Film Chip Resistor; Manufacturer: GENERIC; Manufacturer1 Part Number: 232270672202L; TC: ±100ppm/°C; Table: Resistors SMD; Part Number: R0402_2K2_1%_0.0625W_100PPM; Component Kind: Standard; Component Type: Standard; Pin Count: 2; Value: 2k2; Status: Not recommended; Power: 0.0625W; Tolerance: ±1%; Manufacturer Part Number: R0402_2K2_1%_0.0625W_100PPM; Case: 0402; Mounted: Yes; Socket: No; SMD: Yes; Manufacturer1 Example: YAGEO PHYCOMP; Manufacturer1 ComponentHeight: 0.4mm; HelpURL: \\cern.ch\dfs\Applications\Altium\Datasheets\R0402_Phycomp_RC0402.pdf; Author: CERN DEM JLC; CreateDate: 2007-12-03; LatestRevisionDate: 2012-10-17
R51 R55-R61 = R0402_470R_1%_0.0625W_100PPM: Resistor - 1%; Part Description: General Purpose Thick Film Chip Resistor; Manufacturer: GENERIC; Manufacturer1 Part Number: 232270674701L; TC: ±100ppm/°C; PressFit: No; Part Number: R0402_470R_1%_0.0625W_100PPM; Component Kind: Standard; Component Type: Standard; Pin Count: 2; Value: 470; Status: Not Recommended; Power: 0.0625W; Tolerance: ±1%; Manufacturer Part Number: R0402_470R_1%_0.0625W_100PPM; Case: 0402; Mounted: Yes; Sense: No; Socket: No; SMD: Yes; Manufacturer1 Example: YAGEO PHYCOMP; Manufacturer1 ComponentHeight: 0.4mm; HelpURL: \\cern.ch\dfs\Applications\Altium\Datasheets\R0402_Phycomp_RC0402.pdf; Author: CERN DEM JLC; CreateDate: 03.12.2007; LatestRevisionDate: 17.10.2012
R179 = R0402_100K_1%_0.0625W_100PPM: Resistor - 1%; Part Description: General Purpose Thick Film Chip Resistor; Manufacturer: GENERIC; Manufacturer1 Part Number: 232270671004L; TC: ±100ppm/°C; Table: Resistors SMD; Part Number: R0402_100K_1%_0.0625W_100PPM; Component Kind: Standard; Component Type: Standard; Pin Count: 2; Value: 100k; Status: Not recommended; Power: 0.0625W; Tolerance: ±1%; Manufacturer Part Number: R0402_100K_1%_0.0625W_100PPM; Case: 0402; Mounted: Yes; Socket: No; SMD: Yes; Manufacturer1 Example: YAGEO PHYCOMP; Manufacturer1 ComponentHeight: 0.4mm; HelpURL: \\cern.ch\dfs\Applications\Altium\Datasheets\R0402_Phycomp_RC0402.pdf; Author: CERN DEM JLC; CreateDate: 2007-12-03; LatestRevisionDate: 2012-10-17
TP10-TP14 TP16-TP29 TP31 = SMD_PAD_0.62X0.62MM: as TP2-TP9 on sheet power_supply; Part Number: SMD_PAD_0.62X0.62MM; Component Kind: Standard (No BOM); Component Type: Standard (No BOM); Pin Count: 1; Family: Test Point; Socket: No; SMD: Yes; Sense: No; Status: None; ComponentHeight: 0mm; HelpURL: Undefined; Author: CERN DEM JLC; CreateDate: 12.01.2008; LatestRevisionDate: 12.01.2008; PackageDescription: 0.62mm x 0.62mm PCB Copper Area (SMD Test Point)

## Sheet SAS_Connectors.SchDoc: FMC_ADC
size 420 x 297 mm; Author: G.Kasprowicz; CompanyName: WUT ISE; DrawnBy: G.Kasprowicz; Organization: WUT ISE; Address1: PW ISE; Address2: Nowowiejska 15/19 00-665 Warsaw; Address3: gkasprow@gmail.com; Revision: 2; SheetNumber: -; SheetTotal: -; ModifiedBy: -; CheckedDate: -; Title2: 100M_10B_16CHA_TDC; DivGrp: WUT ISE; Designer: G.Kasprowicz; ModifiedDate: -; ProjectName: Sensor Box
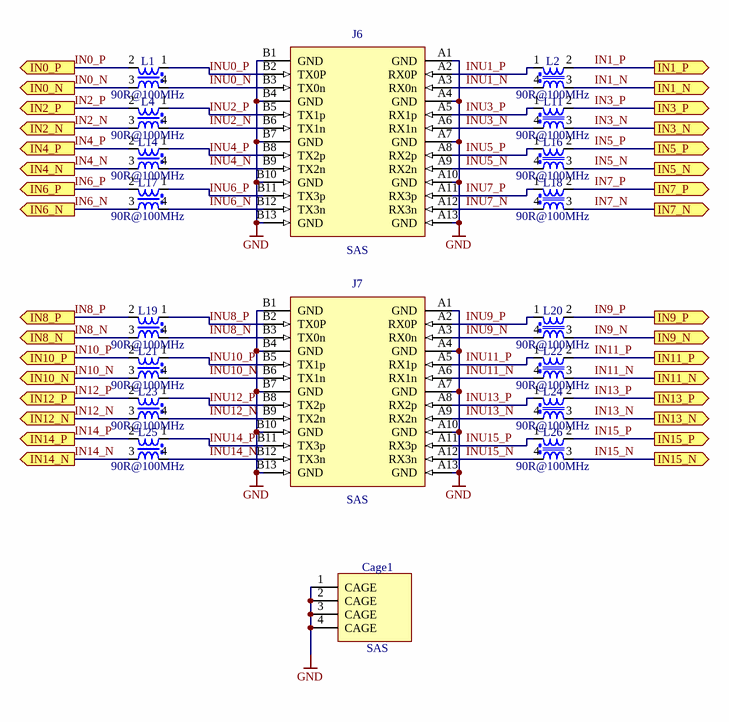
[diagram p11: SAS_Connectors.SchDoc]

### Parts
Cage1  SAS  [TYCO_1888321-2]
J6  SAS  [TYCO_1761987-7]
J7  SAS  [TYCO_1761987-7]
L1  90R@100MHz  [IND_MURATA_DLW21S]
L2  90R@100MHz  [IND_MURATA_DLW21S]
L4  90R@100MHz  [IND_MURATA_DLW21S]
L11  90R@100MHz  [IND_MURATA_DLW21S]
L14  90R@100MHz  [IND_MURATA_DLW21S]
L16  90R@100MHz  [IND_MURATA_DLW21S]
L17  90R@100MHz  [IND_MURATA_DLW21S]
L18  90R@100MHz  [IND_MURATA_DLW21S]
L19  90R@100MHz  [IND_MURATA_DLW21S]
L20  90R@100MHz  [IND_MURATA_DLW21S]
L21  90R@100MHz  [IND_MURATA_DLW21S]
L22  90R@100MHz  [IND_MURATA_DLW21S]
L23  90R@100MHz  [IND_MURATA_DLW21S]
L24  90R@100MHz  [IND_MURATA_DLW21S]
L25  90R@100MHz  [IND_MURATA_DLW21S]
L26  90R@100MHz  [IND_MURATA_DLW21S]

### Ports
IN0_N (out), IN0_P (out), IN1_N (out), IN1_P (out), IN2_N (out), IN2_P (out), IN3_N (out), IN3_P (out), IN4_N (out), IN4_P (out), IN5_N (out), IN5_P (out), IN6_N (out), IN6_P (out), IN7_N (out), IN7_P (out), IN8_N (out), IN8_P (out), IN9_N (out), IN9_P (out), IN10_N (out), IN10_P (out), IN11_N (out), IN11_P (out), IN12_N (out), IN12_P (out), IN13_N (out), IN13_P (out), IN14_N (out), IN14_P (out), IN15_N (out), IN15_P (out)

### Nets
GND: Cage1.1(CAGE) Cage1.2(CAGE) Cage1.3(CAGE) Cage1.4(CAGE) J6.A1(GND) J6.A4(GND) J6.A7(GND) J6.A10(GND) J6.A13(GND) J6.B1(GND) J6.B4(GND) J6.B7(GND) J6.B10(GND) J6.B13(GND) J7.A1(GND) J7.A4(GND) J7.A7(GND) J7.A10(GND) J7.A13(GND) J7.B1(GND) J7.B4(GND) J7.B7(GND) J7.B10(GND) J7.B13(GND)
IN0_N: L1.3 ; port IN0_N
IN0_P: L1.2 ; port IN0_P
IN1_N: L2.3 ; port IN1_N
IN1_P: L2.2 ; port IN1_P
IN2_N: L4.3 ; port IN2_N
IN2_P: L4.2 ; port IN2_P
IN3_N: L11.3 ; port IN3_N
IN3_P: L11.2 ; port IN3_P
IN4_N: L14.3 ; port IN4_N
IN4_P: L14.2 ; port IN4_P
IN5_N: L16.3 ; port IN5_N
IN5_P: L16.2 ; port IN5_P
IN6_N: L17.3 ; port IN6_N
IN6_P: L17.2 ; port IN6_P
IN7_N: L18.3 ; port IN7_N
IN7_P: L18.2 ; port IN7_P
IN8_N: L19.3 ; port IN8_N
IN8_P: L19.2 ; port IN8_P
IN9_N: L20.3 ; port IN9_N
IN9_P: L20.2 ; port IN9_P
IN10_N: L21.3 ; port IN10_N
IN10_P: L21.2 ; port IN10_P
IN11_N: L22.3 ; port IN11_N
IN11_P: L22.2 ; port IN11_P
IN12_N: L23.3 ; port IN12_N
IN12_P: L23.2 ; port IN12_P
IN13_N: L24.3 ; port IN13_N
IN13_P: L24.2 ; port IN13_P
IN14_N: L25.3 ; port IN14_N
IN14_P: L25.2 ; port IN14_P
IN15_N: L26.3 ; port IN15_N
IN15_P: L26.2 ; port IN15_P
INU0_N: J6.B3(TX0n) L1.4
INU0_P: J6.B2(TX0P) L1.1
INU1_N: J6.A3(RX0n) L2.4
INU1_P: J6.A2(RX0P) L2.1
INU2_N: J6.B6(TX1n) L4.4
INU2_P: J6.B5(TX1p) L4.1
INU3_N: J6.A6(RX1n) L11.4
INU3_P: J6.A5(RX1p) L11.1
INU4_N: J6.B9(TX2n) L14.4
INU4_P: J6.B8(TX2p) L14.1
INU5_N: J6.A9(RX2n) L16.4
INU5_P: J6.A8(RX2p) L16.1
INU6_N: J6.B12(TX3n) L17.4
INU6_P: J6.B11(TX3p) L17.1
INU7_N: J6.A12(RX3n) L18.4
INU7_P: J6.A11(RX3p) L18.1
INU8_N: J7.B3(TX0n) L19.4
INU8_P: J7.B2(TX0P) L19.1
INU9_N: J7.A3(RX0n) L20.4
INU9_P: J7.A2(RX0P) L20.1
INU10_N: J7.B6(TX1n) L21.4
INU10_P: J7.B5(TX1p) L21.1
INU11_N: J7.A6(RX1n) L22.4
INU11_P: J7.A5(RX1p) L22.1
INU12_N: J7.B9(TX2n) L23.4
INU12_P: J7.B8(TX2p) L23.1
INU13_N: J7.A9(RX2n) L24.4
INU13_P: J7.A8(RX2p) L24.1
INU14_N: J7.B12(TX3n) L25.4
INU14_P: J7.B11(TX3p) L25.1
INU15_N: J7.A12(RX3n) L26.4
INU15_P: J7.A11(RX3p) L26.1

### Notes on the sheet
- Project/Equipment
- Document
- Designer
- Drawn by
- Check.by
- Copyright WUT ISE 2018.
  This documentation describes Open Hardware and is licensed under the CERN OHL v.1.1. You may redistribute and modify this documentation under the terms of the CERN OHL v.1.1. (http://ohwr.org/CERNOHL). This documentation is distributed WITHOUT ANY EXPRESS OR IMPLIED WARRANTY, INCLUDING OF MERCHANTABILITY, SATISFACTORY QUALITY AND FITNESS FOR A PARTICULAR PURPOSE. Please see the CERN OHL v.1.1 for applicable conditions.
- Contact
- File
- Last Mod.
- Print Date
- Sheet
- Size
- A3
- of
- Rev

### Library data of the parts
Cage1 = CON_SAS_Cage: SAS 2x1 Cage; Part Description: 1x1 Press Fit Cage For Use with QSFP Connector (Quad Small Form-factor Pluggable); Manufacturer: TYCO ELECTRONICS; Manufacturer Part Number: 1888321-2; Part Number: TYCO_1888321-2; Component Kind: Standard; Component Type: Standard; Pin Count: 12; Family: SAS; Mounted: Yes; Socket: No; SMD: Yes; PressFit: Yes; Sense: No; Status: None; ComponentHeight: 9.7mm; HelpURL: \\cern.ch\dfs\Applications\Altium\Datasheets\TYCO_1888617-1.pdf; Author: GK; CreateDate: 04.03.2014; LatestRevisionDate: 04.03.2014
J6 J7 = CON_SAS_1761987-7: 26Position mini SAS Connector; Part Description: Surface Mount EVERCLEAR Mini-SAS Right Angle Host Connector; Manufacturer: TYCO ELECTRONICS; PressFit: No; Part Number: TYCO_1761987-7; Component Kind: Standard; Component Type: Standard; Footprint: TYCO_ 1761987-7; Pin Count: 38; Family: SAS; Mounted: Yes; Socket: No; SMD: No; Sense: No; Status: None; Manufacturer Part Number: 1761987-7; ComponentHeight: 5.55mm; HelpURL: \\cern.ch\dfs\Applications\Altium\Datasheets\TYCO_1761987-9.pdf; Author: GK; CreateDate: 15.07.2013; LatestRevisionDate: 15.07.2013
L1 L2 L4 L11 L14 L16-L26 = IND_MURATA_DLW21SN900SQ2L: Inductor Common Mode; Part Description: Wire Wound Common Mode Choke Coil (DLW21S Series); Manufacturer: MURATA; Power: 330mA; Resistance: 0.35R; Tolerance: ±25%; Part Number: IND_MURATA_DLW21SN900SQ2L; Component Kind: Standard; Component Type: Standard; Pin Count: 4; Value: 90R@100MHz; Status: None; Manufacturer Part Number: DLW21SN900SQ2L; Case: 0805; Mounted: Yes; Socket: No; SMD: Yes; Sense: No; ComponentHeight: 1.4mm; HelpURL: \\cern.ch\dfs\Applications\Altium\Datasheets\IND_MURATA_DLW21S.pdf; Author: CERN DEM JLC; CreateDate: 01.07.2014; LatestRevisionDate: 01.07.2014